# EAGLE design touch_panel_gira-rev1 (EAGLE 5.11)
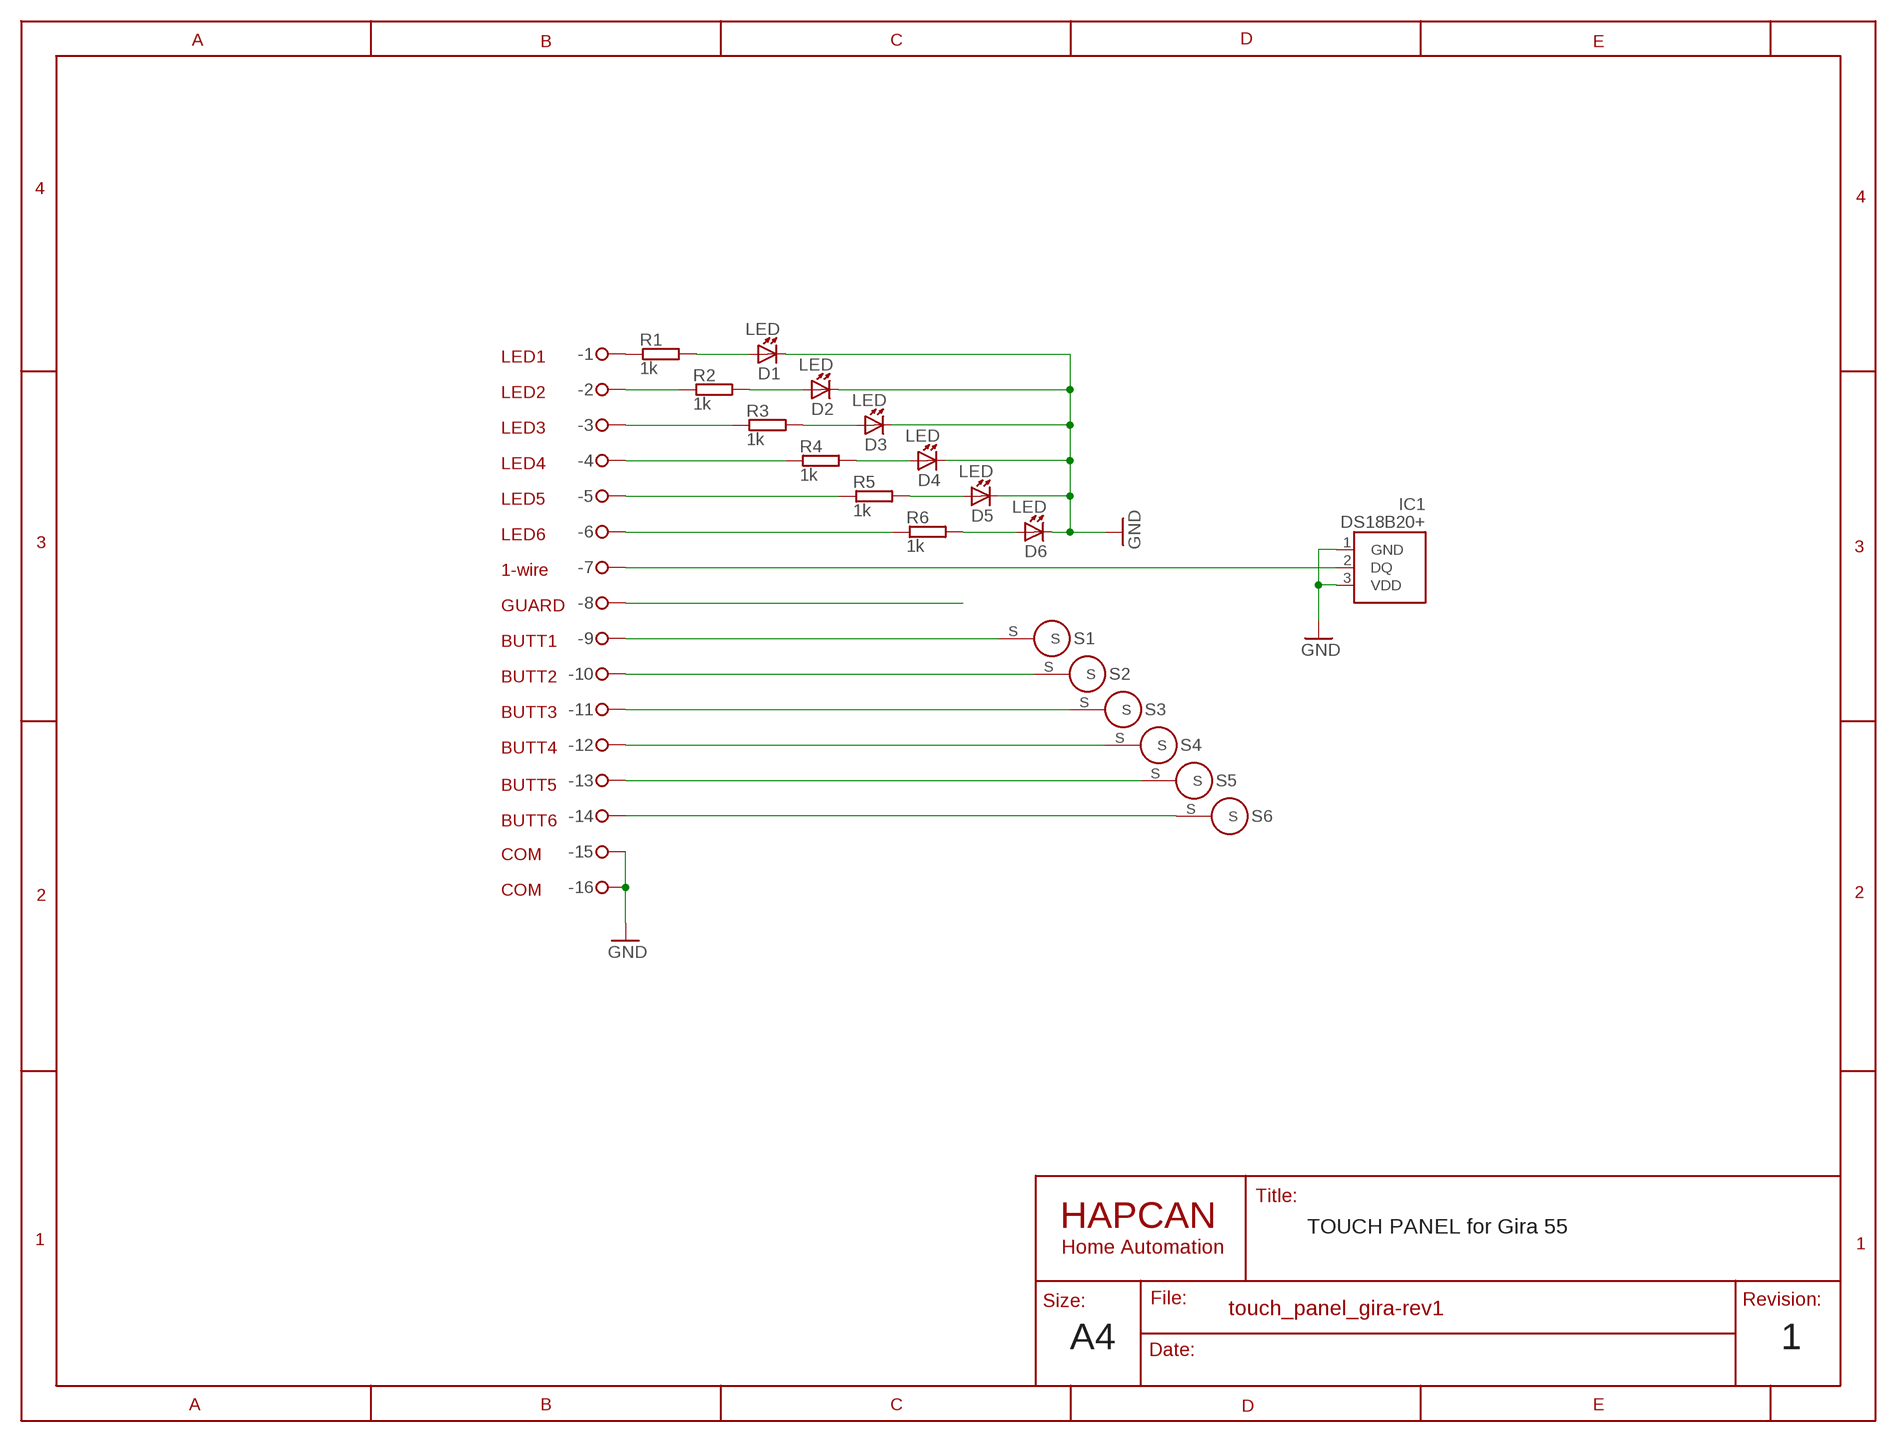
[diagram p0: schematic, sheet 1]

## Parts
-  16pin  HEADER2X8_SMD  [HEADER-2X8_SMD]
D1  LED  DIODE_LED_1206  [1206_LED-R]
D2  LED  DIODE_LED_1206  [1206_LED-R]
D3  LED  DIODE_LED_1206  [1206_LED-R]
D4  LED  DIODE_LED_1206  [1206_LED-R]
D5  LED  DIODE_LED_1206  [1206_LED-R]
D6  LED  DIODE_LED_1206  [1206_LED-R]
IC1  DS18B20+  DS18B20+_TO-92_SMD  [TO-92_SMD]
R1  1k  RESISTOR0805  [0805]
R2  1k  RESISTOR0805  [0805]
R3  1k  RESISTOR0805  [0805]
R4  1k  RESISTOR0805  [0805]
R5  1k  RESISTOR0805  [0805]
R6  1k  RESISTOR0805  [0805]
S1  TOUCH_SENSOR  [TOUCH_SENSOR]
S2  TOUCH_SENSOR  [TOUCH_SENSOR]
S3  TOUCH_SENSOR  [TOUCH_SENSOR]
S4  TOUCH_SENSOR  [TOUCH_SENSOR]
S5  TOUCH_SENSOR  [TOUCH_SENSOR]
S6  TOUCH_SENSOR  [TOUCH_SENSOR]

## Nets
GND: -.P$15 -.P$16 D1.C D2.C D3.C D4.C D5.C D6.C IC1.1(GND) IC1.3(VDD)
N$1: -.P$1 R1.1
N$2: -.P$11 S3.S
N$3: D2.A R2.2
N$4: D3.A R3.2
N$5: D1.A R1.2
N$6: -.P$3 R3.1
N$7: D4.A R4.2
N$8: D5.A R5.2
N$9: D6.A R6.2
N$13: -.P$9 S1.S
N$19: -.P$2 R2.1
N$21: -.P$4 R4.1
N$23: -.P$6 R6.1
N$24: -.P$7 IC1.2(DQ)
N$28: -.P$10 S2.S
N$31: -.P$5 R5.1
N$32: -.P$8
N$38: -.P$12 S4.S
N$41: -.P$14 S6.S
N$48: -.P$13 S5.S

## Notes on the sheet
- LED1
- LED2
- LED3
- LED4
- LED5
- LED6
- 1-wire
- GUARD
- BUTT1
- BUTT2
- BUTT3
- BUTT4
- BUTT5
- BUTT6
- COM
- COM
- TOUCH PANEL for Gira 55
- A4 | 1

## Library data of the parts
- = HAPCAN_devices - UNIV3:HEADER2X8: 16pin connector 2.54 raster
D1-D6 = HAPCAN_devices - UNIV3:DIODE_LED: HAPCAN LED diode
IC1 = HAPCAN_devices - UNIV3:DS18B20+: HAPCAN DS18B20+ temperature sensor
R1-R6 = HAPCAN_devices - UNIV3:RESISTOR: HAPCAN Resistor
S1-S6 = HAPCAN_devices - UNIV3:TOUCH_SENSOR: HAPCAN touch sensor

## Board
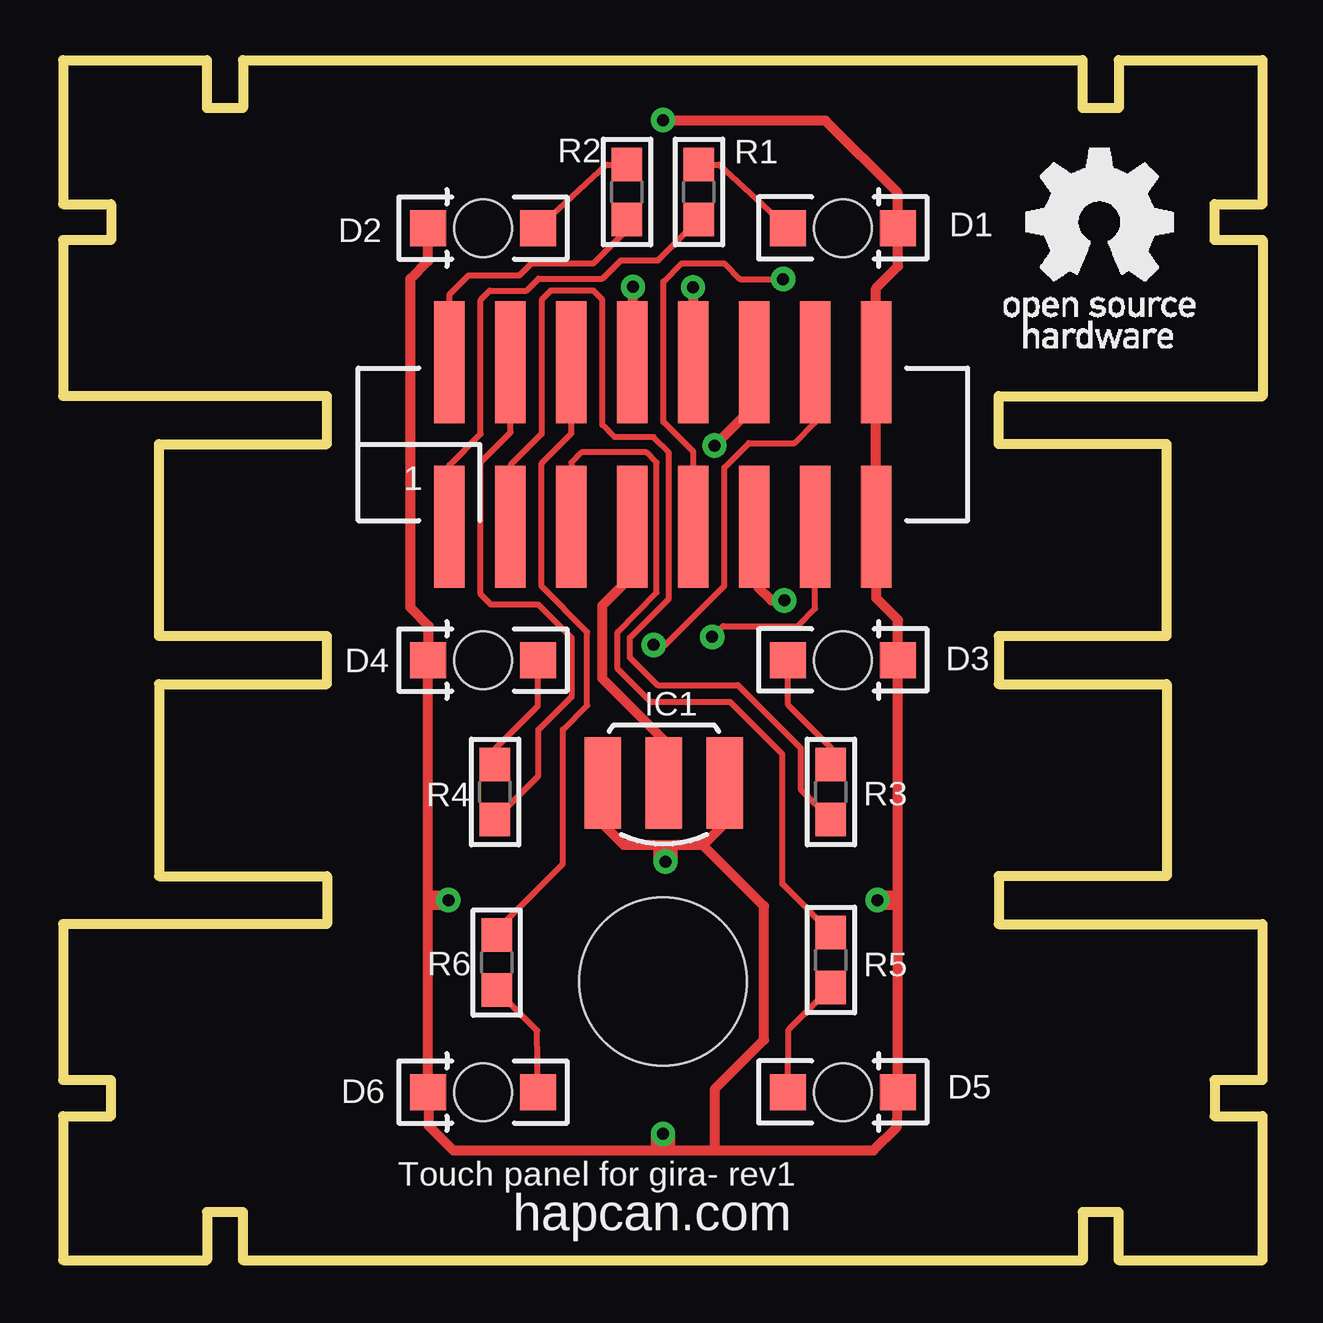
[diagram p1: board, top side]
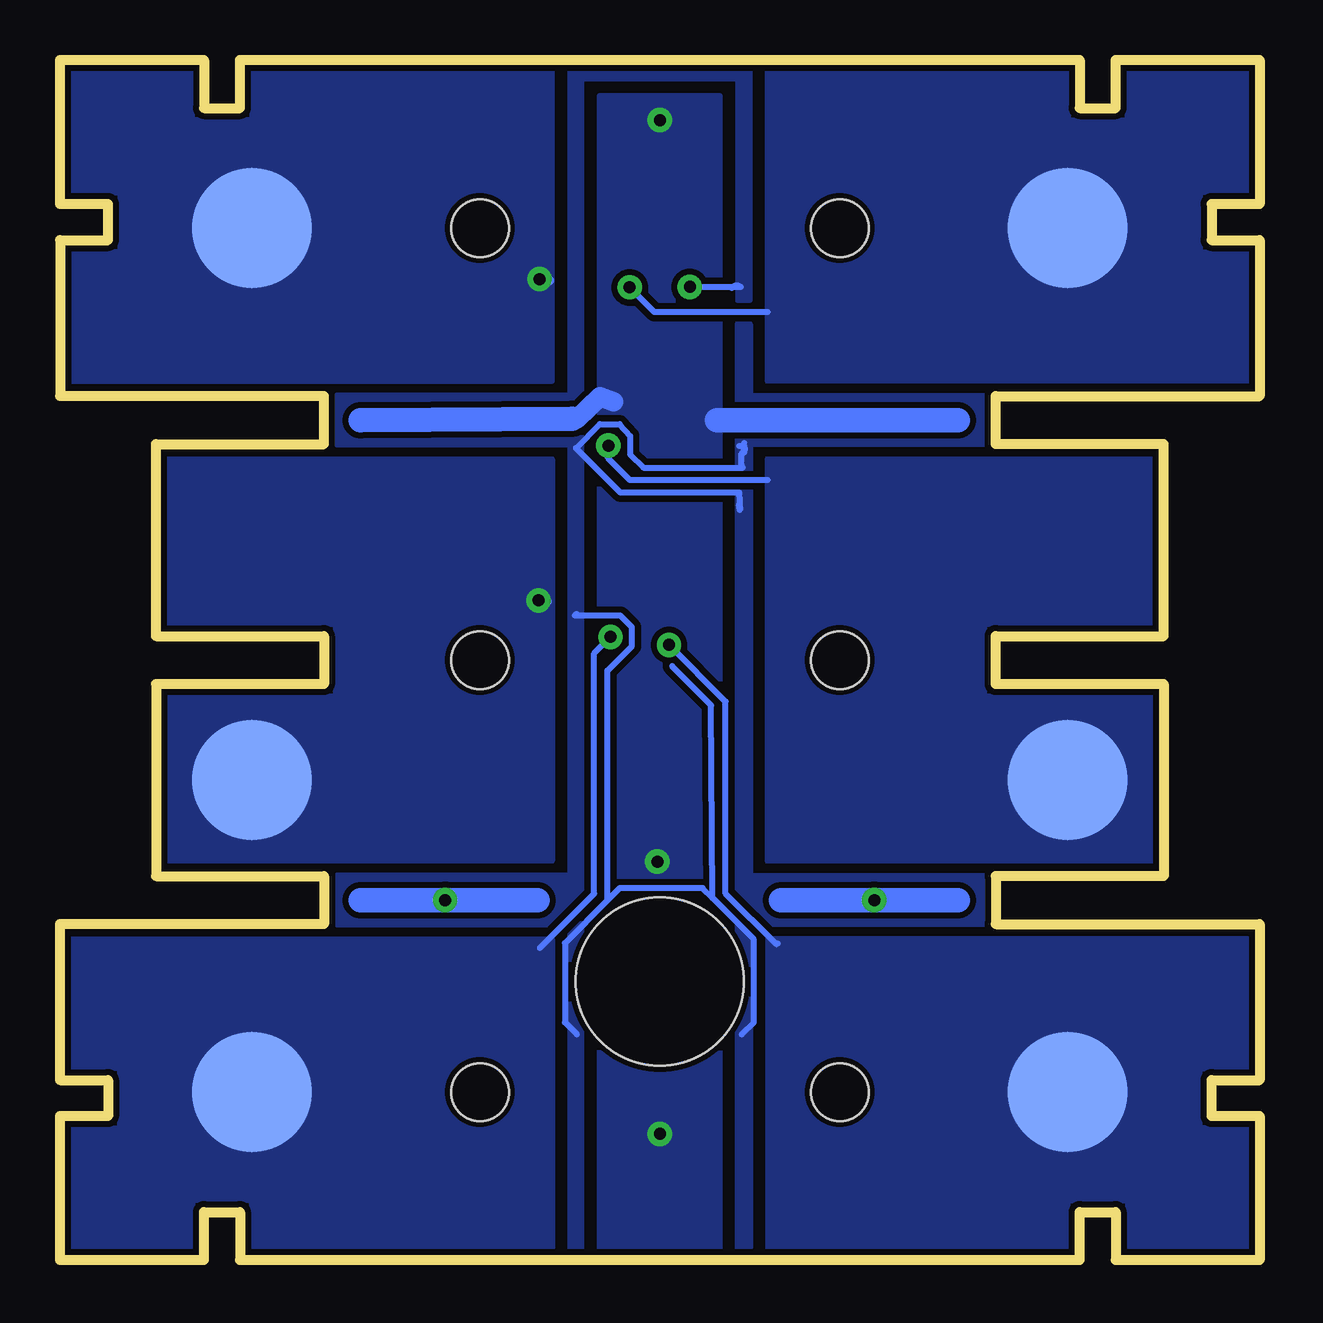
[diagram p2: board, bottom side, seen from below]

Size 50 x 50 mm. Coordinates in mm from the lower left corner, seen from the top.
Outline: 0,50 0,44 2,44 2,42.5 0,42.5 0,36 11,36 11,34 4,34 4,26 11,26 11,24 4,24 4,16 11,16 11,14 0,14 0,7.5 2,7.5 2,6 0,6 0,0 6,0 6,2 7.5,2 7.5,0 42.5,0 42.5,2 44,2 44,0 50,0 50,6 48,6 48,7.5 50,7.5 50,14 39,14 39,16 46,16 46,24 39,24 39,26 46,26 46,34 39,34 39,36 50,36 50,42.5 48,42.5 48,44 50,44 50,50 44,50 44,48 42.5,48 42.5,50 7.5,50 7.5,48 6,48 6,50 0,50
Copper layers (1*16): Top 0.035mm / dielectric 1.5mm / Bottom 0.035mm
Design rules "HAPCAN-Drc *": minimum track width 10mil, minimum drill 0.5mm, track to track 10mil, track to pad 10mil, pad to pad 10mil, via to via 10mil, smd to smd 0mil, copper to edge 10mil, drill to drill 8mil, minimum pad ring 10mil, minimum via ring 10mil, stop-mask expansion 4mil, vias tented up to drill 0mil, thermal gap 10mil
Holes 7 mm at 25,11.6

### Footprints (pad centres in the part's own frame; a part is rotated, then mirrored left to right if it is on the bottom)
HEADER-2X8_SMD = smd 1.27 x 5.08: P$1 -8.89,-3.429; P$2 -8.89,3.429; P$3 -6.35,-3.429; P$4 -6.35,3.429; P$5 -3.81,-3.429; P$6 -3.81,3.429; P$7 -1.27,-3.429; P$8 -1.27,3.429; P$9 1.27,-3.429; P$10 1.27,3.429; P$11 3.81,-3.429; P$12 3.81,3.429; P$13 6.35,-3.429; P$14 6.35,3.429; P$15 8.89,-3.429; P$16 8.89,3.429
1206_LED-R = smd 1.5 x 1.5: A -2.286,0; C 2.286,0 | hole 2.4: 0,0
TO-92_SMD = smd 1.524 x 3.81: 1 2.54,0; 2 0,0; 3 -2.54,0
0805 = smd 1.397 x 1.27: 1 -1.143,0; 2 1.143,0
TOUCH_SENSOR = smd 5 x 5: S 0,0

### Placement (x,y rotation side)
-  24.99,33.99 0 top
D1  32.5,43 0 top
D2  17.5,43 180 top
D3  32.5,25 0 top
D4  17.5,25 180 top
D5  32.5,7 0 top
D6  17.5,7 180 top
IC1  25.04,19.88 180 top
R1  26.5,44.5 90 top
R2  23.5,44.5 90 top
R3  32,19.5 90 top
R4  18,19.5 90 top
R5  32,12.5 270 top
R6  18.07,12.39 270 top
S1  42,43 0 bottom
S2  8,43 0 bottom
S3  42,20 0 bottom
S4  8,20 0 bottom
S5  42,7 0 bottom
S6  8,7 0 bottom

### Tracks (layer width: path | path; a pad name or v marks a point on that pad's centre or on a via)
GND  (via drill 0.5, 0.5 pad 0.81, 0.5 pad 1.02)
  Top 0.254: D1.C 34.95,43 | v25,47.5 25.15,47.47 | 25.1,16.98 25.1,17.29 24.89,17.29 | 27.69,20.57 27.54,20.57 | 25,4.88 25,4.57 25.15,4.57
  Top 0.406: D4.C 15,25.13 | D4.C 14.99,24.73 | 26.67,17.29 24.89,17.29 23.37,17.29 22.5,18.16 IC1.1 | 27.18,4.57 25.15,4.57 16.26,4.57 15.24,5.59 15.24,6.73 D6.C 15.21,14.99 | 27.18,4.57 33.78,4.57 34.75,5.54 D5.C 34.79,14.99 | 27.18,4.57 27.18,7.14 29.21,9.17 29.21,14.75 26.67,17.29 | D4.C 15.24,24.76 15.24,26.42 14.48,27.18 14.48,40.89 15.21,41.63 D2.C | 25.15,47.47 31.78,47.47 34.79,44.46 D1.C 34.8,42.95 34.8,41.4 33.88,40.49 -.P$16 -.P$15 33.89,27.58 34.8,26.67 34.8,24.8 D3.C 34.79,14.99 | 15.21,14.99 D4.C | 15.21,14.99 16,14.99 | 34.79,14.99 34.54,15 | 27.69,20.57 27.58,20.57 IC1.3 27.58,18.2 26.67,17.29
  Top 0.813: v16.06,15 15.51,15 16,14.99 | 34.54,15 v33.94,15
  Top 1.016: 25,4.88 v25,5.25 | 25.1,16.98 v25.1,16.6
  Bottom 0.813: 28.65,35.05 arc1 28.45,35.05 27.48,35.97 26.92,35.76
  Bottom 1.016: 12.57,15 v16.06,15 19.94,15 | 37.47,15 v33.94,15 30.1,15 | 28.65,35.05 37.47,35 | 12.57,35 22.61,35
  pour Bottom: 22.5,48.5 27.5,48.5 27.5,0.5 22.5,0.5
N$1
  Top 0.254: -.P$1 16.1,33.12 17.4,34.42 17.4,40.01 17.78,40.39 19.3,40.39 19.81,40.89 22.48,40.89 23.24,41.66 24.8,41.66 R1.1
N$2  (via drill 0.5)
  Top 0.406: -.P$11 28.7,30.46 29,28 29.52,27.48 v30.05,27.48
  Bottom 0.406: v30.05,27.48 30.1,27.43 29.72,27.43
  pour Bottom: 29.5,16.63 45.5,16.63 45.5,23.5 38.5,23.5 38.5,26.5 45.5,26.5 45.5,33.37 29.5,33.37
N$3
  Top 0.254: R2.2 22.66,45.64 D2.A
N$4
  Top 0.254: R3.2 32,21.34 30.21,23.13 D3.A
N$5
  Top 0.254: 30,42.93 D1.A 27.34,45.64 R1.2
N$6
  Top 0.254: -.P$3 18.65,33.13 19.94,34.42 19.94,40.01 20.32,40.39 22.1,40.39 22.48,40.01 22.48,34.8 22.99,34.29 24.61,34.29 25.25,33.66 25.25,27.56 23.62,25.93 23.62,25.09 24.77,23.95 28.12,23.95 30.73,21.34 30.73,19.62 R3.1
N$7
  Top 0.254: R4.2 18.03,20.68 18.03,21.34 19.79,23.09 D4.A
N$8
  Top 0.254: D5.A 30.24,9.6 R5.2
N$9
  Top 0.254: D6.A 19.76,9.56 R6.2
N$10
  Top 0.01: 0.03,-0.08 arc9 0.04,-0.07 0.08,-0.1 0.1,-0.08 0.07,-0.04 arc19 0.08,-0.02 0.12,-0.01 0.12,0.01 0.08,0.02 arc19 0.07,0.04 0.1,0.08 0.08,0.1 0.04,0.07 arc19 0.02,0.08 0.01,0.12 -0.01,0.12 -0.02,0.08 arc19 -0.04,0.07 -0.08,0.1 -0.1,0.08 -0.07,0.04 arc19 -0.08,0.02 -0.12,0.01 -0.12,-0.01 -0.08,-0.02 arc19 -0.07,-0.04 -0.1,-0.08 -0.08,-0.1 -0.04,-0.07 arc9 -0.03,-0.08 -0.01,-0.04 arc-67 -0.04,0 arc-247 0.01,-0.04 0.03,-0.08
N$13  (via drill 0.5)
  Top 0.254: -.P$9 26.26,33.68 25.02,34.92 25.02,40.77 25.78,41.53 27.56,41.53 28.22,40.87 v30.01,40.87
  Top 0.406: -.P$9
  Bottom 0.254: v30.01,40.87 29.76,40.82
  Bottom 0.406: 29.76,40.82 29.6,40.8
  pour Bottom: 49.5,49.5 49.5,44.5 47.5,44.5 47.5,42 49.5,42 49.5,36.63 29.5,36.63 29.5,49.5 42,49.5 42,47.5 44.5,47.5 44.5,49.5
N$19
  Top 0.254: -.P$2 16.11,40.24 16.89,41.02 19.02,41.02 19.53,41.53 22.1,41.53 23.5,42.93 R2.1
N$21
  Top 0.254: -.P$4 18.65,34.5 17.4,33.25 17.4,27.74 17.83,27.3 19.81,27.3 21.21,25.91 21.21,23.5 19.81,22.1 19.81,20.17 R4.1
N$23
  Top 0.254: 21.18,37.42 21.18,34.44 19.94,33.2 19.94,28.07 21.84,26.16 21.84,23.11 20.83,22.1 20.83,16.51 18.07,13.75 R6.1
  Top 0.406: 21.18,37.42 -.P$6
N$24
  Top 0.406: IC1.2 25,21.7 22.48,24.22 22.48,27.28 23.5,28.3 23.5,30.33 -.P$7
N$28  (via drill 0.5)
  Top 0.406: v26.25,40.53 -.P$10
  Bottom 0.254: v26.25,40.53 25.23,39.5 20.5,39.5
  pour Bottom: 0.5,49.5 0.5,44.5 2.5,44.5 2.5,42 0.5,42 0.5,36.63 20.5,36.63 20.5,49.5 8,49.5 8,47.5 5.5,47.5 5.5,49.5
N$31
  Top 0.254: -.P$5 21.18,33.22 21.61,33.66 24.31,33.66 24.74,33.22 24.74,27.81 23.11,26.16 23.11,24.64 24.51,23.24 27.81,23.24 29.97,21.08 29.97,15.67 R5.1
  Top 0.406: -.P$5 arc-90 21.34,30.43
N$32  (via drill 0.5)
  Top 0.254: -.P$8 23.75,37.41
  Top 0.406: 23.75,37.41 v23.75,40.54
  Bottom 0.254: v23.75,40.54 21.63,40.54 arc-90 22,40.5 | 21.69,31.5 21.67,31.24 21.69,31.98 26.64,31.98 28.5,33.83 27.51,34.82 26.67,34.82 26.24,34.34 26.24,33.55 25.68,33.02 21.54,33.02 21.59,33.12 21.59,33.6 21.54,33.6 21.54,33.66 21.49,33.66 21.49,33.91 21.69,33.91 | 21.44,33.78 21.49,34.04 | 27.18,14.99 28.96,13.21 28.96,9.91 28.45,9.4 | 22.81,15.09 21.08,13.36 21.08,9.91 21.59,9.4 | 22.81,15.09 23.22,15.49 26.67,15.49 27.18,14.99 | 27.18,14.99 27.18,24.56 26.16,25.58 26.16,26.36 26.64,26.85 28.55,26.85 28.47,26.92 28.45,26.92 | 22.81,15.09 22.86,23.11 24.49,24.74
  pour Bottom: 21.25,40 21.25,49.5 28.75,49.5 28.75,36.01 38.5,36.01 38.5,33.99 28.75,33.99 28.75,16.01 38.5,16.01 38.5,13.99 28.75,13.99 28.75,0.5 28.25,0.5 28.25,49.25 21.75,49.25 21.75,40
  pour Bottom: 21.75,39 21.25,39 21.25,36.01 11.5,36.01 11.5,33.99 21.25,33.99 21.25,16.01 11.5,16.01 11.5,13.99 21.25,13.99 21.25,0.5 21.75,0.5
N$38  (via drill 0.5)
  Top 0.406: v27.14,33.93 28.81,35.59 -.P$12
  Bottom 0.254: 20.5,32.5 26.24,32.5 27.15,33.41 27.15,34.05 v27.14,33.93
  pour Bottom: 20.5,33.37 4.5,33.37 4.5,26.5 11.5,26.5 11.5,23.5 4.5,23.5 4.5,16.63 20.5,16.63
N$41  (via drill 0.5)
  Top 0.254: -.P$14 31.34,34.9 30.48,34.04 28.57,34.04 27.56,33.02 27.56,28.09 25.09,25.63 v24.61,25.63
  Bottom 0.254: v24.61,25.63 22.25,23.27 22.25,15.27 20.14,13.16 | 20.12,13.18 20.12,13.16 20.14,13.16 | 20.12,13.18 20.09,13.18 | 20.12,13.18 20.14,13.18 20.14,13.16
  pour Bottom: 0.5,0.5 0.5,5.5 2.5,5.5 2.5,8 0.5,8 0.5,13.37 20.5,13.37 20.5,0.5 8,0.5 8,2.5 5.5,2.5 5.5,0.5
N$48  (via drill 0.5)
  Top 0.254: -.P$13 31.34,27.15 30.61,26.42 27.51,26.42 v27.05,25.96
  Bottom 0.254: 30,13.01 27.74,15.27 27.74,25.27 v27.05,25.96
  pour Bottom: 49.5,0.5 49.5,5.5 47.5,5.5 47.5,8 49.5,8 49.5,13.37 29.5,13.37 29.5,0.5 42,0.5 42,2.5 44.5,2.5 44.5,0.5

### Text on the board
tNames: Touch panel for gira- rev1 | hapcan.com